# Altium schematic sheet [10]-FPGA_Bank_3_Interface.SchDoc
size A4
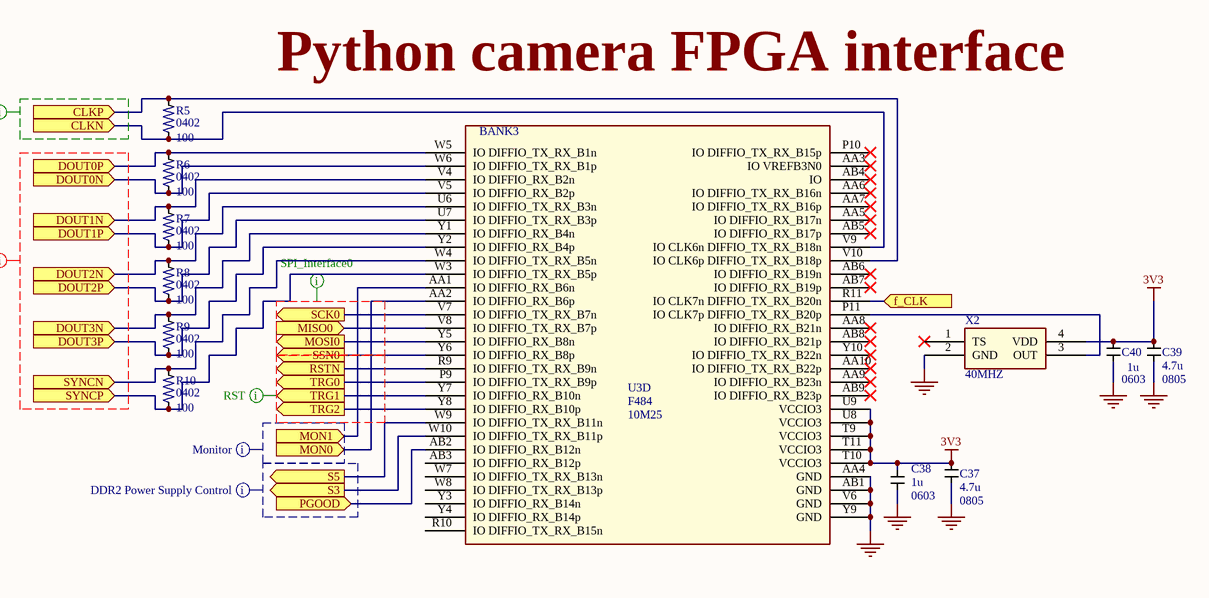
[diagram p0: [10]-FPGA_Bank_3_Interface.SchDoc]

## Parts
C37  4.7u  PCB Package: 0805  [*CAPC2013X140N]
C38  1u  PCB Layer:: 0603  [*0603]
C39  4.7u  PCB Package: 0805  [*CAPC2013X140N]
C40  1u  PCB Layer:: 0603  [*0603]
R5  100  PCB footprint: 0402  [*R0402]
R6  100  PCB footprint: 0402  [*R0402]
R7  100  PCB footprint: 0402  [*R0402]
R8  100  PCB footprint: 0402  [*R0402]
R9  100  PCB footprint: 0402  [*R0402]
R10  100  PCB footprint: 0402  [*R0402]
U3  10M25  Package Type: F484  [*BGA484C100P22X22_2300X2300X200N]  (part D of 9)
X2  40MHZ  [OSC_DSC6083CI2A-032K768]

## Ports
CLKN (in), CLKP (in), DOUT0N (in), DOUT0P (in), DOUT1N (in), DOUT1P (in), DOUT2N (in), DOUT2P (in), DOUT3N (in), DOUT3P (in), f_CLK (in), MISO0 (in), MON0 (in), MON1 (in), MOSI0 (out), PGOOD (in), RSTN (out), S3 (out), S5 (out), SCK0 (out), SSN0 (out), SYNCN (in), SYNCP (in), TRG0 (out), TRG1 (out), TRG2 (out)

## Nets
3V3: C37.2 C38.2 C39.2 C40.2 U3.T9(VCCIO3) U3.T10(VCCIO3) U3.T11(VCCIO3) U3.U8(VCCIO3) U3.U9(VCCIO3) X2.4(VDD)
GND: C37.1 C38.1 C39.1 C40.1 U3.AA4(GND) U3.AB1(GND) U3.V6(GND) U3.Y9(GND) X2.2(GND)
CLKN: R5.1 U3.V9(IO_CLK6n_DIFFIO_TX_RX_B18n) ; port CLKN
CLKP: R5.2 U3.V10(IO_CLK6p_DIFFIO_TX_RX_B18p) ; port CLKP
DOUT0N: R6.1 U3.W6(IO_DIFFIO_TX_RX_B1p) ; port DOUT0N
DOUT0P: R6.2 U3.W5(IO_DIFFIO_TX_RX_B1n) ; port DOUT0P
DOUT1N: R7.2 U3.V4(IO_DIFFIO_RX_B2n) ; port DOUT1N
DOUT1P: R7.1 U3.V5(IO_DIFFIO_RX_B2p) ; port DOUT1P
DOUT2N: R8.2 U3.U6(IO_DIFFIO_TX_RX_B3n) ; port DOUT2N
DOUT2P: R8.1 U3.U7(IO_DIFFIO_TX_RX_B3p) ; port DOUT2P
DOUT3N: R9.2 U3.Y1(IO_DIFFIO_RX_B4n) ; port DOUT3N
DOUT3P: R9.1 U3.Y2(IO_DIFFIO_RX_B4p) ; port DOUT3P
f_CLK: U3.R11(IO_CLK7n_DIFFIO_TX_RX_B20n) ; port f_CLK
MISO0: U3.V8(IO_DIFFIO_TX_RX_B7p) ; port MISO0
MON0: U3.AA2(IO_DIFFIO_RX_B6p) ; port MON0
MON1: U3.AA1(IO_DIFFIO_RX_B6n) ; port MON1
MOSI0: U3.Y5(IO_DIFFIO_RX_B8n) ; port MOSI0
PGOOD: U3.AB2(IO_DIFFIO_RX_B12n) ; port PGOOD
RSTN: U3.R9(IO_DIFFIO_TX_RX_B9n) ; port RSTN
S3: U3.W10(IO_DIFFIO_TX_RX_B11p) ; port S3
S5: U3.W9(IO_DIFFIO_TX_RX_B11n) ; port S5
SCK0: U3.V7(IO_DIFFIO_TX_RX_B7n) ; port SCK0
SSN0: U3.Y6(IO_DIFFIO_RX_B8p) ; port SSN0
SYNCN: R10.2 U3.W4(IO_DIFFIO_TX_RX_B5n) ; port SYNCN
SYNCP: R10.1 U3.W3(IO_DIFFIO_TX_RX_B5p) ; port SYNCP
TRG0: U3.P9(IO_DIFFIO_TX_RX_B9p) ; port TRG0
TRG1: U3.Y7(IO_DIFFIO_RX_B10n) ; port TRG1
TRG2: U3.Y8(IO_DIFFIO_RX_B10p) ; port TRG2
NetU3_P11: U3.P11(IO_CLK7p_DIFFIO_TX_RX_B20p) X2.3(OUT)

Not connected (* = marked no-connect by the designer): U3 AA3(IO_VREFB3N0)* AA5(IO_DIFFIO_RX_B17n)* AA6(IO_DIFFIO_TX_RX_B16n)* AA7(IO_DIFFIO_TX_RX_B16p)* AA8(IO_DIFFIO_RX_B21n)* AA9(IO_DIFFIO_RX_B23n)* AA10(IO_DIFFIO_TX_RX_B22p)* AB3(IO_DIFFIO_RX_B12p) AB4(IO)* AB5(IO_DIFFIO_RX_B17p)* AB6(IO_DIFFIO_RX_B19n)* AB7(IO_DIFFIO_RX_B19p)* AB8(IO_DIFFIO_RX_B21p)* AB9(IO_DIFFIO_RX_B23p)* P10(IO_DIFFIO_TX_RX_B15p)* R10(IO_DIFFIO_TX_RX_B15n) W7(IO_DIFFIO_TX_RX_B13n) W8(IO_DIFFIO_TX_RX_B13p) Y3(IO_DIFFIO_RX_B14n) Y4(IO_DIFFIO_RX_B14p) Y10(IO_DIFFIO_TX_RX_B22n)*; X2 1(TS)*

## Layout directives
mark named Data_out: (no net found under the mark)
mark named Out_Clock: (no net found under the mark)
mark named Monitor: (no net found under the mark)
mark named SPI_Interface0: (no net found under the mark)
mark named RST: TRG1
mark named DDR2 Power Supply Control: (no net found under the mark)

## Notes on the sheet
- Python camera FPGA interface
- (in symbol Component_1, part D) BANK3

## Library data of the parts
C37-C40 = Component_1
  C37 C39: Buying URL:: https://uk.farnell.com/avx/08053d475kat2a/cap-4-7-f-25v-10-x5r-0805/dp/1657932?st=4.7u%200805
  C38 C40: Buying URL:: https://uk.farnell.com/avx/0603yc105kat2a/cap-1-f-16v-10-x7r-0603/dp/1658870RL?st=1u%200603
R5-R10 = RP73D1J76R8BTDG: Res Thin Film 0603 76.8 Ohm 0.1% 1/10W Â±15ppm/Â°C Molded SMD Paper T/R; Buying URL:: https://uk.farnell.com/yageo/rc0402fr-07100rl/res-100r-1-0-0625w-0402-thick/dp/9239111
U3 = Component_1: Part no.: 10M25DAF484I7G
X2 = Component_1: mf_part no.: DSC1001CL5-040.0000; Manufactured by: MICROCHIP